# Altium schematic sheet model_14.schdoc
size 603 x 417 mm
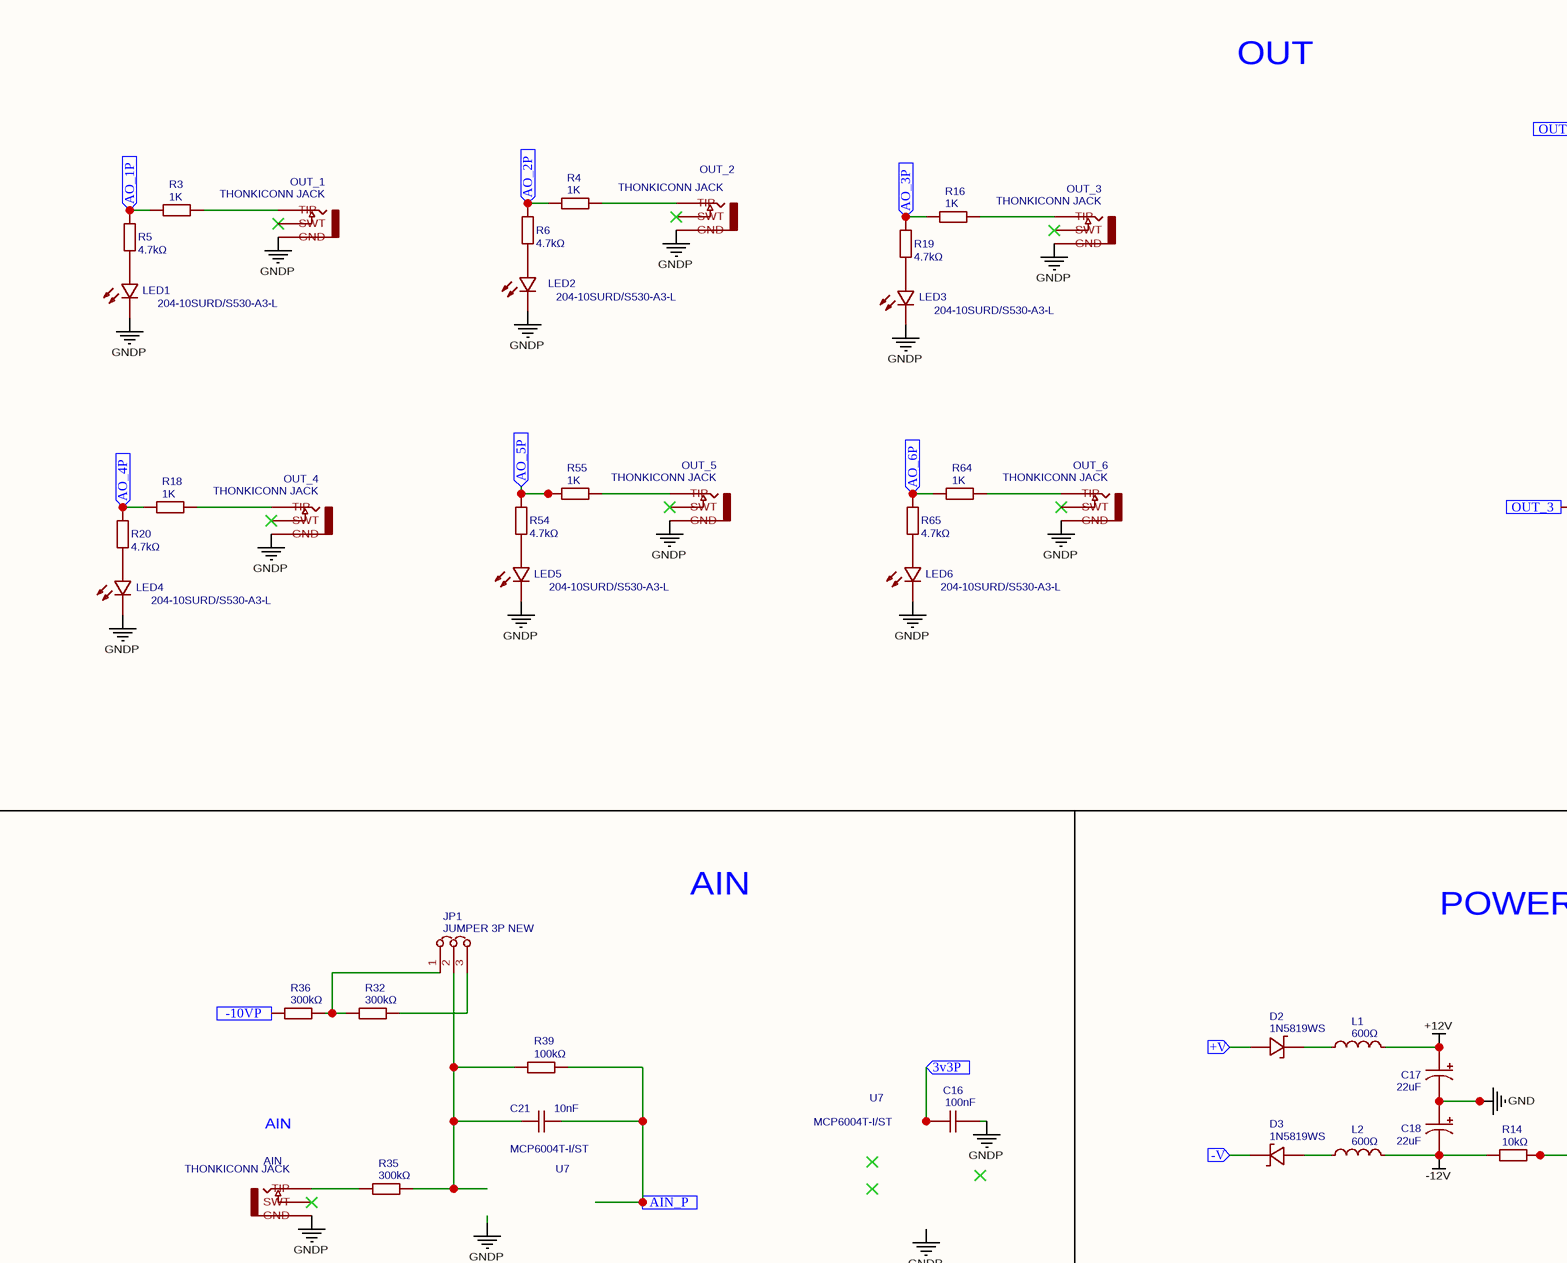
[diagram p0: model_14.schdoc, top left]
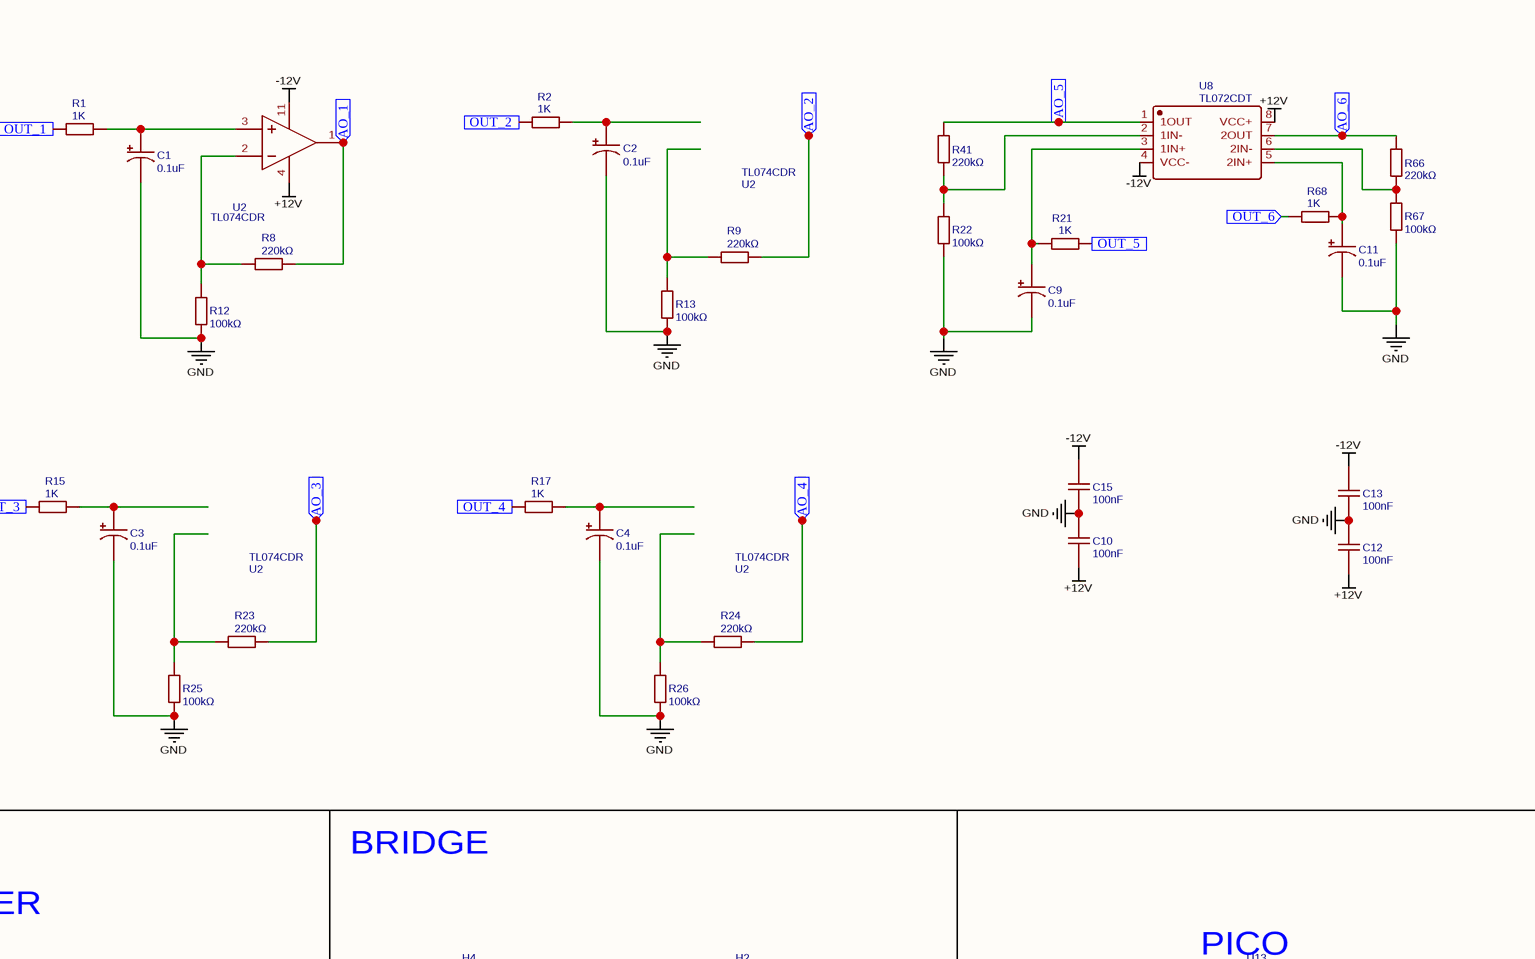
[diagram p1: model_14.schdoc, top right]
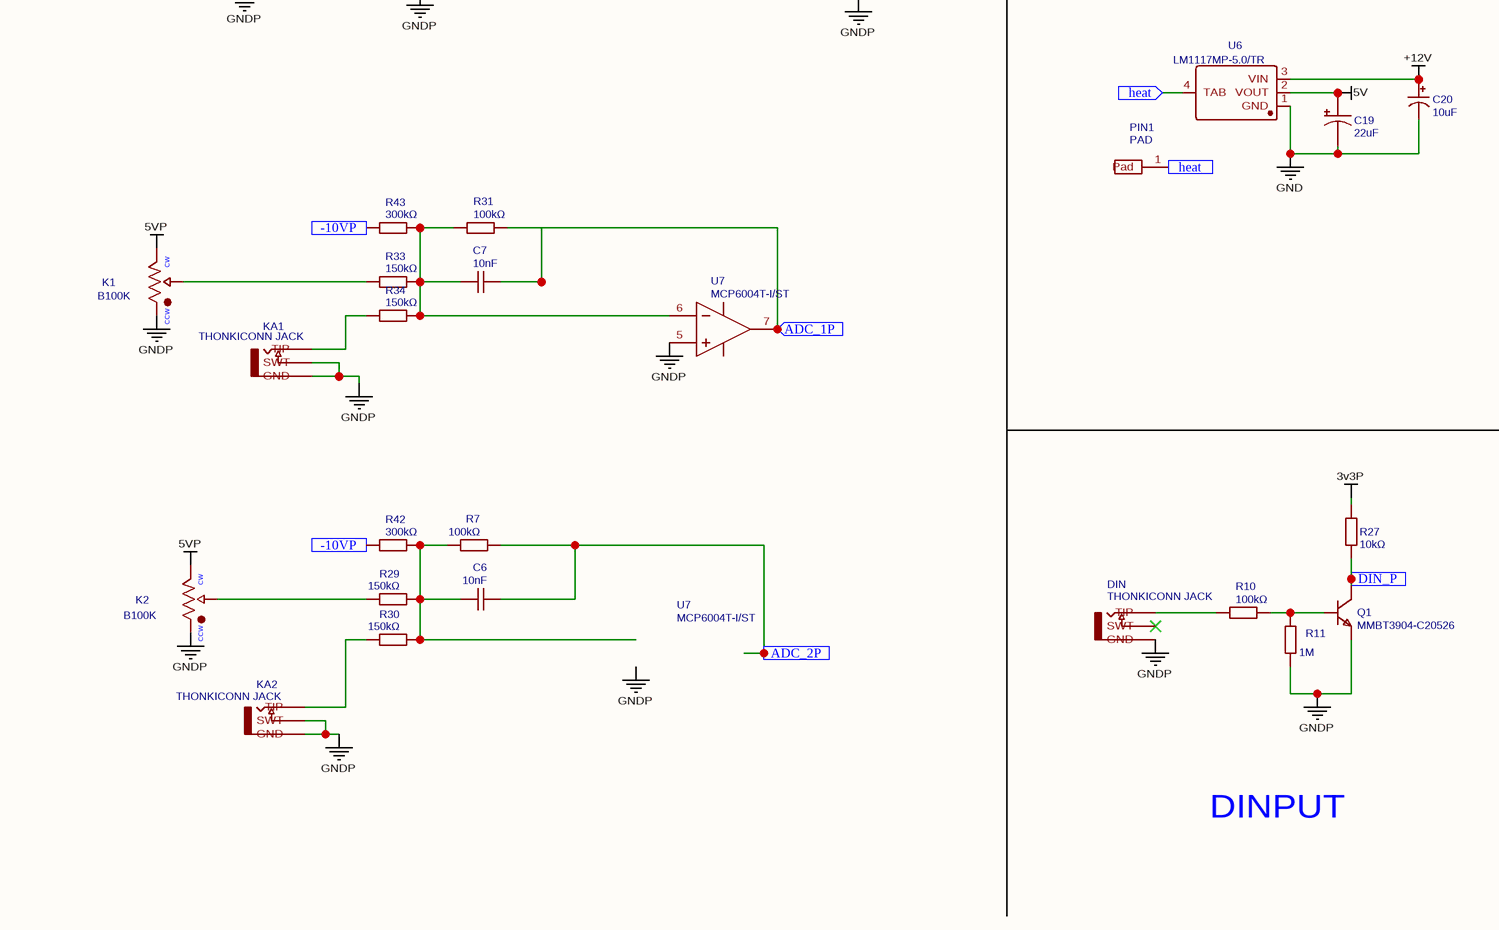
[diagram p2: model_14.schdoc, bottom left]
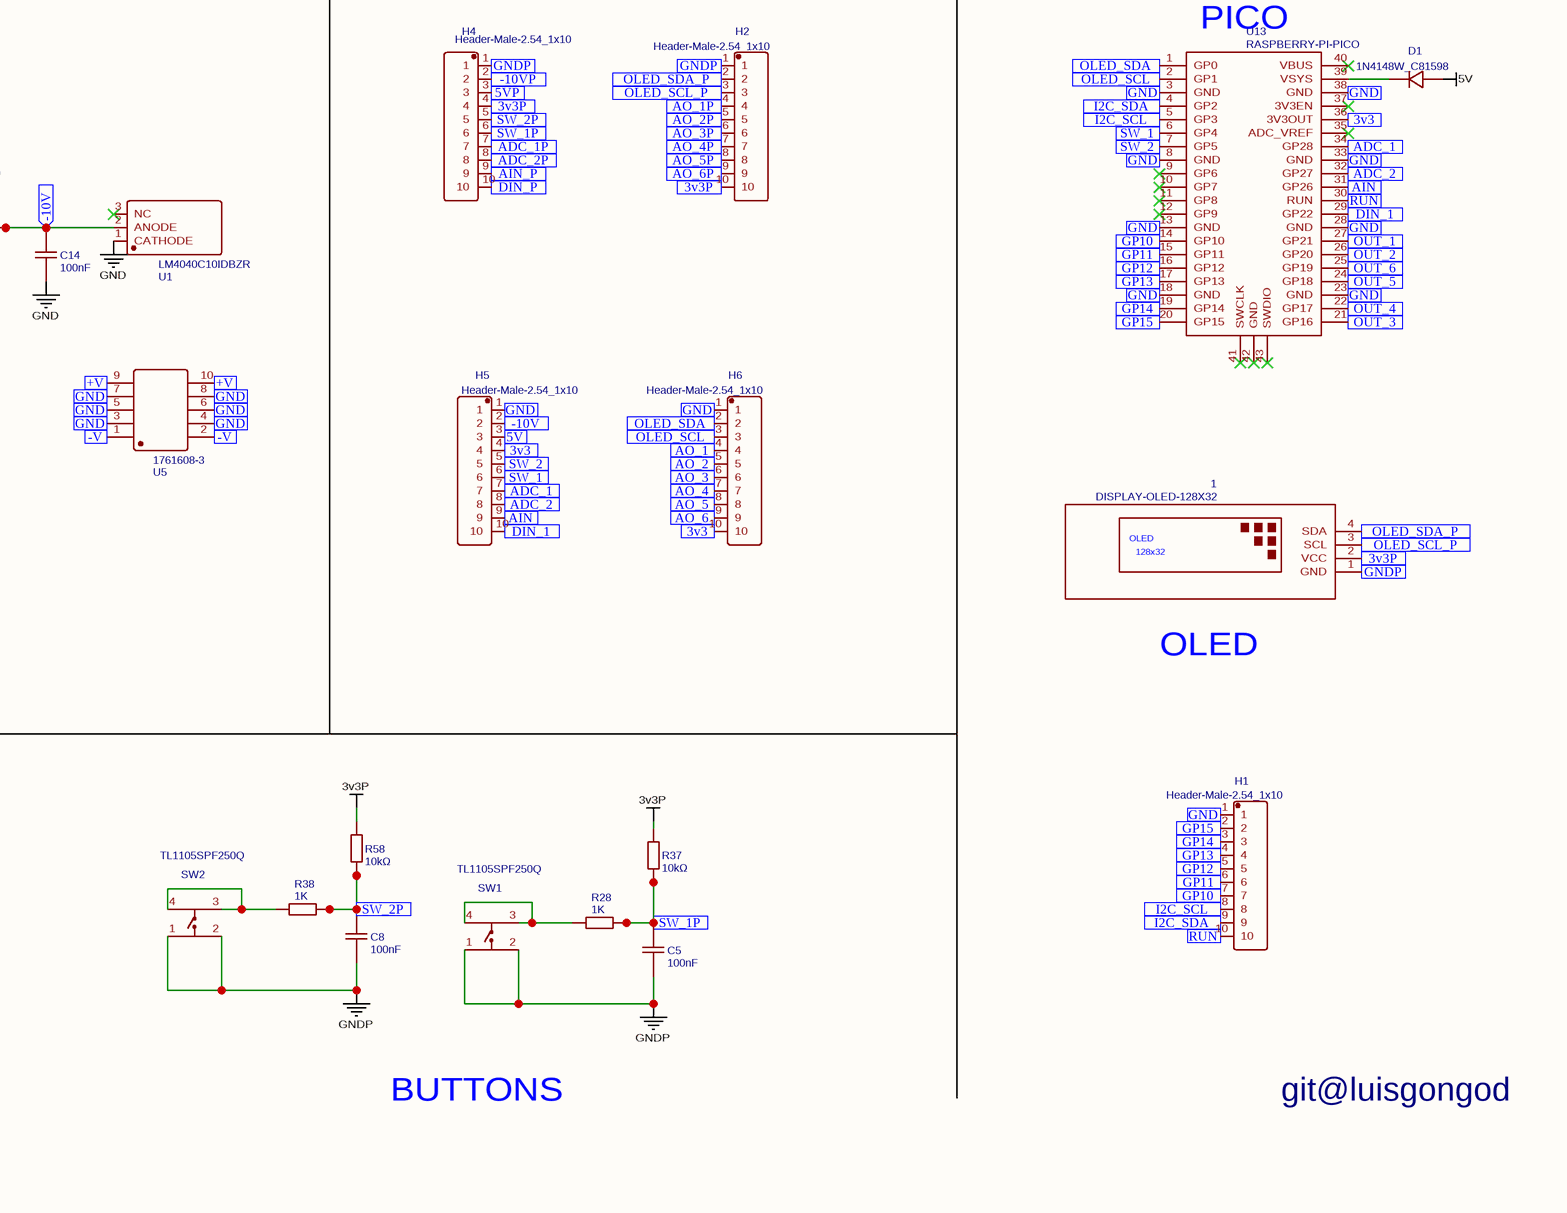
[diagram p3: model_14.schdoc, bottom right]

## Parts
(Parts that share a designator on the sheet are numbered #1, #2 ... from top to bottom, then left to right.)
1  DISPLAY-OLED-128X32  [DISPLAY-OLED-128X32]
AIN  THONKICONN JACK  [THONKICONN_JACK]
C1  0.1uF  [CAP-SMD_BD4.0-L4.3-W4.3-FD]
C2  0.1uF  [CAP-SMD_BD4.0-L4.3-W4.3-FD]
C3  0.1uF  [CAP-SMD_BD4.0-L4.3-W4.3-FD]
C4  0.1uF  [CAP-SMD_BD4.0-L4.3-W4.3-FD]
C5  100nF  [C0603]
C6  10nF  [C0603]
C7  10nF  [C0603]
C8  100nF  [C0603]
C9  0.1uF  [CAP-SMD_BD4.0-L4.3-W4.3-FD]
C10  100nF  [C0603]
C11  0.1uF  [CAP-SMD_BD4.0-L4.3-W4.3-FD]
C12  100nF  [C0603]
C13  100nF  [C0603]
C14  100nF  [C0603]
C15  100nF  [C0603]
C16  100nF  [C0603]
C17  22uF  [CAP-SMD_BD5.0-L5.3-W5.3-FD]
C18  22uF  [CAP-SMD_BD5.0-L5.3-W5.3-FD]
C19  22uF  [CAP-SMD_BD5.0-L5.3-W5.3-FD]
C20  10uF  [CAP-SMD_BD5.0-L5.3-W5.3-FD]
C21  10nF  [C0603]
D1  1N4148W_C81598  [SOD-123F_L2.7-W1.6-LS3.8-RD]
D2  1N5819WS  [SOD-323_L1.8-W1.3-LS2.5-RD]
D3  1N5819WS  [SOD-323_L1.8-W1.3-LS2.5-RD]
DIN  THONKICONN JACK  [THONKICONN_JACK]
H1  Header-Male-2.54_1x10  [HDR-TH_10P-P2.54-V-M-1]
H2  Header-Male-2.54_1x10  [HDR-TH_10P-P2.54-V-M-1]
H4  Header-Male-2.54_1x10  [HDR-TH_10P-P2.54-V-M-1]
H5  Header-Male-2.54_1x10  [HDR-TH_10P-P2.54-V-M-1]
H6  Header-Male-2.54_1x10  [HDR-TH_10P-P2.54-V-M-1]
JP1  JUMPER 3P NEW  [JUMPERS_SMT-JUMPER_3_NC_PASTE_NO-SILK]
K1  B100K  [ALPHA9MM_TRIM]
K2  B100K  [ALPHA9MM_TRIM]
KA1  THONKICONN JACK  [THONKICONN_JACK]
KA2  THONKICONN JACK  [THONKICONN_JACK]
L1  600Ω  [L0805]
L2  600Ω  [L0805]
LED1  204-10SURD/S530-A3-L  [LED-TH_BD3.0-P2.54-FD]
LED2  204-10SURD/S530-A3-L  [LED-TH_BD3.0-P2.54-FD]
LED3  204-10SURD/S530-A3-L  [LED-TH_BD3.0-P2.54-FD]
LED4  204-10SURD/S530-A3-L  [LED-TH_BD3.0-P2.54-FD]
LED5  204-10SURD/S530-A3-L  [LED-TH_BD3.0-P2.54-FD]
LED6  204-10SURD/S530-A3-L  [LED-TH_BD3.0-P2.54-FD]
OUT_1  THONKICONN JACK  [THONKICONN_JACK]
OUT_2  THONKICONN JACK  [THONKICONN_JACK]
OUT_3  THONKICONN JACK  [THONKICONN_JACK]
OUT_4  THONKICONN JACK  [THONKICONN_JACK]
OUT_5  THONKICONN JACK  [THONKICONN_JACK]
OUT_6  THONKICONN JACK  [THONKICONN_JACK]
PIN1  PAD  [PADPAD]
Q1  MMBT3904-C20526  [SOT-23-3_L2.9-W1.3-P1.90-LS2.4-BR]
R1  1K  [R0603]
R2  1K  [R0603]
R3  1K  [R0603]
R4  1K  [R0603]
R5  4.7kΩ  [R0603]
R6  4.7kΩ  [R0603]
R7  100kΩ  [R0603]
R8  220kΩ  [R0603]
R9  220kΩ  [R0603]
R10  100kΩ  [R0603]
R11  1M  [R0603]
R12  100kΩ  [R0603]
R13  100kΩ  [R0603]
R14  10kΩ  [R0603]
R15  1K  [R0603]
R16  1K  [R0603]
R17  1K  [R0603]
R18  1K  [R0603]
R19  4.7kΩ  [R0603]
R20  4.7kΩ  [R0603]
R21  1K  [R0603]
R22  100kΩ  [R0603]
R23  220kΩ  [R0603]
R24  220kΩ  [R0603]
R25  100kΩ  [R0603]
R26  100kΩ  [R0603]
R27  10kΩ  [R0603]
R28  1K  [R0603]
R29  150kΩ  [R0603]
R30  150kΩ  [R0603]
R31  100kΩ  [R0603]
R32  300kΩ  [R0603]
R33  150kΩ  [R0603]
R34  150kΩ  [R0603]
R35  300kΩ  [R0603]
R36  300kΩ  [R0603]
R37  10kΩ  [R0603]
R38  1K  [R0603]
R39  100kΩ  [R0603]
R41  220kΩ  [R0603]
R42  300kΩ  [R0603]
R43  300kΩ  [R0603]
R54  4.7kΩ  [R0603]
R55  1K  [R0603]
R58  10kΩ  [R0603]
R64  1K  [R0603]
R65  4.7kΩ  [R0603]
R66  220kΩ  [R0603]
R67  100kΩ  [R0603]
R68  1K  [R0603]
SW1  TL1105SPF250Q  [KEY-TH_4P-L6.0-W6.0-P4.50-LS7.5]
SW2  TL1105SPF250Q  [KEY-TH_4P-L6.0-W6.0-P4.50-LS7.5]
U1  LM4040C10IDBZR  [SOT-23-3_L3.0-W1.7-P0.95-LS2.9-BR]
U2#1  TL074CDR  [SOIC-14_L8.7-W3.9-P1.27-LS6.0-BL]
U2#2  TL074CDR  [SOIC-14_L8.7-W3.9-P1.27-LS6.0-BL]
U2#3  TL074CDR  [SOIC-14_L8.7-W3.9-P1.27-LS6.0-BL]
U2#4  TL074CDR  [SOIC-14_L8.7-W3.9-P1.27-LS6.0-BL]
U5  1761608-3  [IDC-TH_10P-P2.54-S2.54_L9.2-W20.3]
U6  LM1117MP-5.0/TR  [SOT-223-3_L6.5-W3.4-P2.30-LS7.0-BR]
U7#1  MCP6004T-I/ST  [TSSOP-14_L5.0-W4.4-P0.65-LS6.4-BL]
U7#2  MCP6004T-I/ST  [TSSOP-14_L5.0-W4.4-P0.65-LS6.4-BL]
U7#3  MCP6004T-I/ST  [TSSOP-14_L5.0-W4.4-P0.65-LS6.4-BL]
U7#4  MCP6004T-I/ST  [TSSOP-14_L5.0-W4.4-P0.65-LS6.4-BL]
U8  TL072CDT  [SOIC-8_L5.0-W4.0-P1.27-LS6.0-BL]
U13  RASPBERRY-PI-PICO  [RASPBERRY-PI-PICO]

## Ports
3v3 (in), 3v3P (in), 5V (in), 5VP (in), +V (in), -10V (in), -10VP (in), -V (in), ADC_1 (in), ADC_1P (in), ADC_2 (in), ADC_2P (in), AIN (in), AIN_P (in), AO_1 (in), AO_1P (in), AO_2 (in), AO_2P (in), AO_3 (in), AO_3P (in), AO_4 (in), AO_4P (in), AO_5 (in), AO_5P (in), AO_6 (in), AO_6P (in), DIN_1 (in), DIN_P (in), GND (in), GNDP (in), GP10 (in), GP11 (in), GP12 (in), GP13 (in), GP14 (in), GP15 (in), heat (in), I2C_SCL (in), I2C_SDA (in), OLED_SCL (in), OLED_SCL_P (in), OLED_SDA (in), OLED_SDA_P (in), OUT_1 (in), OUT_2 (in), OUT_3 (in), OUT_4 (in), OUT_5 (in), OUT_6 (in), RUN (in), SW_1 (in), SW_1P (in), SW_2 (in), SW_2P (in)

## Nets
3v3P: R27.2 R37.2 R58.2
5V: C19.1 D1.2(A) U6.2(VOUT)
5VP: K1.3 K2.3
+12V: C10.1 C12.1 C17.1 C20.1 L1.2 U2#2.4(VCC+) U6.3(VIN) U8.8(VCC+)
-12V: C13.2 C15.2 C18.2 L2.2 R14.1 U2#2.11(VCC-) U8.4(VCC-)
GND: C1.2 C2.2 C3.2 C4.2 C9.2 C10.2 C11.2 C12.2 C13.1 C14.1 C15.1 C17.2 C18.1 C19.2 C20.2 R12.1 R13.1 R22.1 R25.1 R26.1 R67.1 U1.1(CATHODE) U6.1(GND)
GNDP: AIN.1(GND) C5.1 C8.1 C16.2 DIN.1(GND) K1.1 K2.1 KA1.1(GND) KA1.2(SWT) KA2.1(GND) KA2.2(SWT) LED1.2(K) LED2.2(K) LED3.2(K) LED4.2(K) LED5.2(K) LED6.2(K) OUT_1.1(GND) OUT_2.1(GND) OUT_3.1(GND) OUT_4.1(GND) OUT_5.1(GND) OUT_6.1(GND) Q1.2(E) R11.1 SW1.1 SW1.2 SW2.1 SW2.2 U7#3.5(VINB+)
3v3: H5.4 H6.10 U13.36(3V3OUT) ; port 3v3
3v3P: 1.2(VCC) C16.1 H2.10 H4.4 ; port 3v3P  [a separate net that carries the same name]
5V: H5.3 ; port 5V  [a separate net that carries the same name]
5VP: H4.3 ; port 5VP  [a separate net that carries the same name]
+V: D2.2(A) U5.9 U5.10 ; port +V
-10V: C14.2 H5.2 R14.2 U1.2(ANODE) ; port -10V
-10VP: H4.2 R36.1 R42.1 R43.1 ; port -10VP
-V: D3.1(C) U5.1 U5.2 ; port -V
ADC_1: H5.7 U13.34(GP28) ; port ADC_1
ADC_1P: C7.2 H4.7 R31.2 U7#3.7(VOUTB) ; port ADC_1P
ADC_2: H5.8 U13.32(GP27) ; port ADC_2
ADC_2P: C6.1 H4.8 R7.1 ; port ADC_2P
AIN: H5.9 U13.31(GP26) ; port AIN
AIN_P: C21.2 H4.9 R39.2 ; port AIN_P
AO_1: H6.4 R8.2 U2#2.1(OUT1) ; port AO_1
AO_1P: H2.4 R3.1 R5.1 ; port AO_1P
AO_2: H6.5 R9.2 ; port AO_2
AO_2P: H2.5 R4.1 R6.1 ; port AO_2P
AO_3: H6.6 R23.2 ; port AO_3
AO_3P: H2.6 R16.1 R19.1 ; port AO_3P
AO_4: H6.7 R24.2 ; port AO_4
AO_4P: H2.7 R18.1 R20.1 ; port AO_4P
AO_5: H6.8 R41.2 U8.1(1OUT) ; port AO_5
AO_5P: H2.8 R54.1 R55.1 ; port AO_5P
AO_6: H6.9 R66.2 U8.7(2OUT) ; port AO_6
AO_6P: H2.9 R64.1 R65.1 ; port AO_6P
DIN_1: H5.10 U13.29(GP22) ; port DIN_1
DIN_P: H4.10 Q1.3(C) R27.1 ; port DIN_P
GND: H1.1 H5.1 H6.1 U5.3 U5.4 U5.5 U5.6 U5.7 U5.8 U13.3(GND) U13.8(GND) U13.13(GND) U13.18(GND) U13.23(GND) U13.28(GND) U13.33(GND) U13.38(GND) ; port GND  [a separate net that carries the same name]
GNDP: 1.1(GND) H2.1 H4.1 ; port GNDP  [a separate net that carries the same name]
GP10: H1.7 U13.14(GP10) ; port GP10
GP11: H1.6 U13.15(GP11) ; port GP11
GP12: H1.5 U13.16(GP12) ; port GP12
GP13: H1.4 U13.17(GP13) ; port GP13
GP14: H1.3 U13.19(GP14) ; port GP14
GP15: H1.2 U13.20(GP15) ; port GP15
heat: PIN1.1(Pad) U6.4(TAB) ; port heat
I2C_SCL: H1.8 U13.5(GP3) ; port I2C_SCL
I2C_SDA: H1.9 U13.4(GP2) ; port I2C_SDA
OLED_SCL: H6.3 U13.2(GP1) ; port OLED_SCL
OLED_SCL_P: 1.3(SCL) H2.3 ; port OLED_SCL_P
OLED_SDA: H6.2 U13.1(GP0) ; port OLED_SDA
OLED_SDA_P: 1.4(SDA) H2.2 ; port OLED_SDA_P
OUT_1: R1.1 U13.27(GP21) ; port OUT_1
OUT_2: R2.1 U13.26(GP20) ; port OUT_2
OUT_3: R15.1 U13.21(GP16) ; port OUT_3
OUT_4: R17.1 U13.22(GP17) ; port OUT_4
OUT_5: R21.1 U13.24(GP18) ; port OUT_5
OUT_6: R68.1 U13.25(GP19) ; port OUT_6
RUN: H1.10 U13.30(RUN) ; port RUN
SW_1: H5.6 U13.6(GP4) ; port SW_1
SW_1P: C5.2 H4.6 R28.2 R37.1 ; port SW_1P
SW_2: H5.5 U13.7(GP5) ; port SW_2
SW_2P: C8.2 H4.5 R38.2 R58.1 ; port SW_2P
NetAIN_3: AIN.3(TIP) R35.1
NetC1_1: C1.1 R1.2 U2#2.3(IN1+)
NetC2_1: C2.1 R2.2
NetC3_1: C3.1 R15.2
NetC4_1: C4.1 R17.2
NetC6_2: C6.2 R7.2 R29.1 R30.1 R42.2
NetC7_1: C7.1 R31.1 R33.2 R34.2 R43.2 U7#3.6(VINB-)
NetC9_1: C9.1 R21.2 U8.3(1IN+)
NetC11_1: C11.1 R68.2 U8.5(2IN+)
NetC21_1: C21.1 JP1.2 R35.2 R39.1
NetD1_1: D1.1(K) U13.39(VSYS)
NetD2_1: D2.1(C) L1.1
NetD3_2: D3.2(A) L2.1
NetDIN_3: DIN.3(TIP) R10.1
NetJP1_1: JP1.1 R32.1 R36.2
NetJP1_3: JP1.3 R32.2
NetK1_2: K1.2 R33.1
NetK2_2: K2.2 R29.2
NetKA1_3: KA1.3(TIP) R34.1
NetKA2_3: KA2.3(TIP) R30.2
NetLED1_1: LED1.1(A) R5.2
NetLED2_1: LED2.1(A) R6.2
NetLED3_1: LED3.1(A) R19.2
NetLED4_1: LED4.1(A) R20.2
NetLED5_1: LED5.1(A) R54.2
NetLED6_1: LED6.1(A) R65.2
NetOUT_1_3: OUT_1.3(TIP) R3.2
NetOUT_2_3: OUT_2.3(TIP) R4.2
NetOUT_3_3: OUT_3.3(TIP) R16.2
NetOUT_4_3: OUT_4.3(TIP) R18.2
NetOUT_5_3: OUT_5.3(TIP) R55.2
NetOUT_6_3: OUT_6.3(TIP) R64.2
NetQ1_1: Q1.1(B) R10.2 R11.2
NetR8_1: R8.1 R12.2 U2#2.2(IN1-)
NetR9_1: R9.1 R13.2
NetR22_2: R22.2 R41.1 U8.2(1IN-)
NetR23_1: R23.1 R25.2
NetR24_1: R24.1 R26.2
NetR28_1: R28.1 SW1.3 SW1.4
NetR38_1: R38.1 SW2.3 SW2.4
NetR66_1: R66.1 R67.2 U8.6(2IN-)

Not connected (* = marked no-connect by the designer): AIN 2(SWT)*; DIN 2(SWT)*; OUT_1 2(SWT)*; OUT_2 2(SWT)*; OUT_3 2(SWT)*; OUT_4 2(SWT)*; OUT_5 2(SWT)*; OUT_6 2(SWT)*; U1 3(NC)*; U13 9(GP6)* 10(GP7)* 11(GP8)* 12(GP9)* 35(ADC_VREF)* 37(3V3EN)* 40(VBUS)* 41(SWCLK)* 42(GND)* 43(SWDIO)*

## Notes on the sheet
- OUT
- BRIDGE
- AIN
- POWER
- (near U13) PICO
- OLED
- DINPUT
- BUTTONS
- git@luisgongod
- Labels drawn without touching a wire or pin: GNDP
- (in symbol B100K) CW; CCW
- (in symbol DISPLAY-OLED-128X32) OLED; 128x32

## Library data of the parts
1 = DISPLAY-OLED-128X32: Contributor: gtanaka6; spicePre: ?; spiceSymbolName: DISPLAY-OLED-128X32
AIN DIN KA1 KA2 OUT_1-OUT_6 = THONKICONN JACK: Contributor: Schafmag; spicePre: J; spiceSymbolName: THONKICONN JACK
C1-C4 C9 C11 = 0.1uF: BOM_Manufacturer: Changzhou Huawei Elec; BOM_Manufacturer Part: VT1H0R1MB054000CE0; nameAlias: Capacitance; Contributor: LCSC; BOM_Supplier: LCSC; BOM_Supplier Part: C271438; BOM_JLCPCB Part Class: Extended Part; spicePre: C; spiceSymbolName: VT1H0R1MB054000CE0
C5 C8 C10 C12-C16 = 100nF: BOM_Manufacturer: YAGEO; BOM_Manufacturer Part: CC0603KRX7R9BB104; nameAlias: Capacitance; BOM_Supplier: LCSC; BOM_Supplier Part: C14663; BOM_JLCPCB Part Class: Basic Part; spicePre: C; spiceSymbolName: CC0603KRX7R9BB104
C6 C7 C21 = 10nF: BOM_Manufacturer: FH; BOM_Manufacturer Part: 0603B103K500NT; nameAlias: Capacitance; BOM_Supplier: LCSC; BOM_Supplier Part: C57112; BOM_JLCPCB Part Class: Basic Part; spicePre: C; spiceSymbolName: 0603B103K500NT
C17-C19 = 22uF: BOM_Manufacturer: ROQANG; BOM_Manufacturer Part: VT1V220M0505; nameAlias: Capacitance; Contributor: LCSC; BOM_Paste Type: expand; BOM_Supplier: LCSC; BOM_Supplier Part: C239256; spicePre: C; spiceSymbolName: VT1V220M0505
C20 = 10uF: BOM_Manufacturer: ROQANG; BOM_Manufacturer Part: RVT1H100M0505; nameAlias: Capacitance; BOM_Supplier: LCSC; BOM_Supplier Part: C72487; BOM_JLCPCB Part Class: Extended Part; spicePre: C; spiceSymbolName: RVT1H100M0505
D1 = 1N4148W_C81598: BOM_Manufacturer: SEMTECH; BOM_Supplier: LCSC; BOM_Manufacturer Part: 1N4148W; BOM_Supplier Part: C81598; BOM_JLCPCB Part Class: Basic Part; spicePre: D; spiceSymbolName: 1N4148W_C81598
D2 D3 = 1N5819WS: BOM_Manufacturer: Guangdong Hottech; Contributor: LCSC; BOM_Supplier: LCSC; BOM_Supplier Part: C191023; BOM_Manufacturer Part: 1N5819WS; BOM_JLCPCB Part Class: Basic Part; spicePre: D; spiceSymbolName: 1N5819WS
H1 H2 H4-H6 = Header-Male-2.54_1x10: BOM_Manufacturer Part: Headers  Pins2.54mm1*10P; BOM_Supplier: LCSC; BOM_Supplier Part: C57369; BOM_JLCPCB Part Class: Extended Part; spicePre: H; spiceSymbolName: Header-Male-2.54_1x10
JP1 = JUMPER 3P NEW: Contributor: Boon Jun; spicePre: J; spiceSymbolName: JUMPER 3P NEW
K1 K2 = B100K: BOM_Manufacturer Part: Alpha 9mm; Contributor: Stefan; spicePre: R; spiceSymbolName: ALPHA 9MM VERTICAL TRIM
L1 L2 = 600Ω: BOM_Manufacturer: Sunlord; BOM_Manufacturer Part: GZ2012D601TF; nameAlias: Value; BOM_Supplier: LCSC; BOM_Supplier Part: C1017; BOM_JLCPCB Part Class: Basic Part; spicePre: L; spiceSymbolName: GZ2012D601TF
LED1-LED6 = 204-10SURD/S530-A3-L: BOM_Manufacturer: EVERLIGHT; BOM_Supplier: LCSC; BOM_Manufacturer Part: 204-10SURD/S530-A3-L; BOM_Supplier Part: C99771; BOM_JLCPCB Part Class: Extended Part; spicePre: L; spiceSymbolName: 204-10SURD/S530-A3-L
PIN1 = PAD: Contributor: Zayden; spicePre: P; spiceSymbolName: PAD
Q1 = MMBT3904-C20526: BOM_Manufacturer: CJ; Contributor: 立创EDA官方封装库; BOM_Supplier: LCSC; BOM_Manufacturer Part: MMBT3904; BOM_Supplier Part: C20526; BOM_JLCPCB Part Class: Basic Part; spicePre: Q; spiceSymbolName: MMBT3904-C20526
R1-R4 R15-R18 R21 R28 R38 R55 R64 R68 = 1K: BOM_Manufacturer: UniOhm; BOM_Manufacturer Part: 0603WAF1001T5E; nameAlias: Resistance (Ohms); SMT Type: Basic; BOM_Paste Type: base; BOM_Supplier: LCSC; BOM_Supplier Part: C21190; BOM_JLCPCB SMD: Yes; BOM_LCSC Assembly: Yes; spicePre: R; spiceSymbolName: 0603WAF1001T5E
R5 R6 R19 R20 R54 R65 = 4.7kΩ: BOM_Manufacturer: UniOhm; BOM_Manufacturer Part: 0603WAF4701T5E; nameAlias: Resistance; Resistance (Ohms): 4.7K; BOM_Supplier: LCSC; BOM_Supplier Part: C23162; BOM_JLCPCB Part Class: Basic Part; spicePre: R; spiceSymbolName: 0603WAF4701T5E
R7 R10 R12 R13 R22 R25 R26 R31 R39 R67 = 100kΩ: BOM_Manufacturer: UniOhm; BOM_Manufacturer Part: 0603WAF1003T5E; nameAlias: Resistance; Resistance (Ohms): 100K; BOM_Supplier: LCSC; BOM_Supplier Part: C25803; BOM_JLCPCB Part Class: Basic Part; spicePre: R; spiceSymbolName: 0603WAF1003T5E
R8 R9 R23 R24 R41 R66 = 220kΩ: BOM_Manufacturer: UniOhm; BOM_Manufacturer Part: 0603WAF2203T5E; nameAlias: Resistance; Resistance (Ohms): 220K; BOM_Supplier: LCSC; BOM_Supplier Part: C22961; BOM_JLCPCB Part Class: Basic Part; spicePre: R; spiceSymbolName: 0603WAF2203T5E
R11 = 1M: BOM_Manufacturer: UniOhm; BOM_Manufacturer Part: 0603WAF1001T5E; nameAlias: Resistance (Ohms); SMT Type: Basic; BOM_Paste Type: base; BOM_Supplier: LCSC; BOM_Supplier Part: C21190; BOM_JLCPCB SMD: Yes; BOM_LCSC Assembly: Yes; spicePre: R; spiceSymbolName: 0603WAF1001T5E
R14 R27 R37 R58 = 10kΩ: BOM_Manufacturer: UniOhm; BOM_Manufacturer Part: 0603WAF1002T5E; nameAlias: Resistance; Resistance (Ohms): 10K; BOM_Supplier: LCSC; BOM_Supplier Part: C25804; BOM_JLCPCB Part Class: Basic Part; spicePre: R; spiceSymbolName: 0603WAF1002T5E
R29 R30 R33 R34 = 150kΩ: BOM_Manufacturer: UniOhm; BOM_Manufacturer Part: 0603WAF1503T5E; nameAlias: Resistance; Resistance (Ohms): 150K; BOM_Supplier: LCSC; BOM_Supplier Part: C22807; BOM_JLCPCB Part Class: Basic Part; spicePre: R; spiceSymbolName: 0603WAF1503T5E
R32 R35 R36 R42 R43 = 300kΩ: BOM_Manufacturer: UniOhm; BOM_Manufacturer Part: 0603WAF3003T5E; nameAlias: Resistance; Resistance (Ohms): 300K; BOM_Supplier: LCSC; BOM_Supplier Part: C23024; BOM_JLCPCB Part Class: Basic Part; spicePre: R; spiceSymbolName: 0603WAF3003T5E
SW1 SW2 = TL1105SPF250Q: BOM_Manufacturer: E-Switch; Contributor: LCSC; BOM_Supplier: LCSC; BOM_Supplier Part: C273486; BOM_Manufacturer Part: TL1105SPF250Q; BOM_JLCPCB Part Class: Extended Part; spicePre: S; spiceSymbolName: TL1105SPF250Q
U1 = LM4040C10IDBZR: BOM_Manufacturer: Texas Instruments; Contributor: LCSC; BOM_Supplier: LCSC; BOM_Supplier Part: C201738; BOM_Manufacturer Part: LM4040C10IDBZR; BOM_JLCPCB Part Class: Extended Part; spicePre: U; spiceSymbolName: LM4040C10IDBZR
U2#1-U2#4 = TL074CDR: BOM_Manufacturer: TI; subpart_no: 2; tags: FET Operational Amplifier; BOM_Supplier Part: C12594; BOM_Supplier: LCSC; BOM_Manufacturer Part: TL074CDR; BOM_JLCPCB Part Class: Extended Part; spicePre: U; spiceSymbolName: TL074CDR
U5 = 1761608-3: BOM_Manufacturer: TE Connectivity; Contributor: LCSC; BOM_Supplier: LCSC; BOM_Supplier Part: C305912; BOM_Manufacturer Part: 1761608-3; spicePre: U; spiceSymbolName: 1761608-3
U6 = LM1117MP-5.0/TR: BOM_Manufacturer: HGSEMI; Contributor: LCSC; BOM_Supplier: LCSC; BOM_Supplier Part: C498151; BOM_Manufacturer Part: LM1117MP-5.0/TR; BOM_JLCPCB Part Class: Extended Part; spicePre: U; spiceSymbolName: LM1117MP-5.0/TR
U7#1-U7#4 = MCP6004T-I/ST: BOM_Manufacturer: MICROCHIP; subpart_no: 1; BOM_Supplier Part: C50282; BOM_Supplier: LCSC; BOM_Manufacturer Part: MCP6004T-I/ST; BOM_JLCPCB Part Class: Extended Part; spicePre: U; spiceSymbolName: MCP6004T-I/ST
U8 = TL072CDT: BOM_Manufacturer: STMicroelectronics; BOM_Supplier: LCSC; BOM_Manufacturer Part: TL072CDT; BOM_Supplier Part: C6961; BOM_JLCPCB Part Class: Basic Part; spicePre: U; spiceSymbolName: TL072CDT
U13 = RASPBERRY-PI-PICO: Contributor: kazhida; spicePre: U; spiceSymbolName: RASPBERRY-PI-PICO